# Altium schematic sheet Serial to USB Converter.SchDoc: Serial to USB Converter
size 292 x 193 mm; DocumentNumber: 29; SheetNumber: 16; SheetTotal: 28
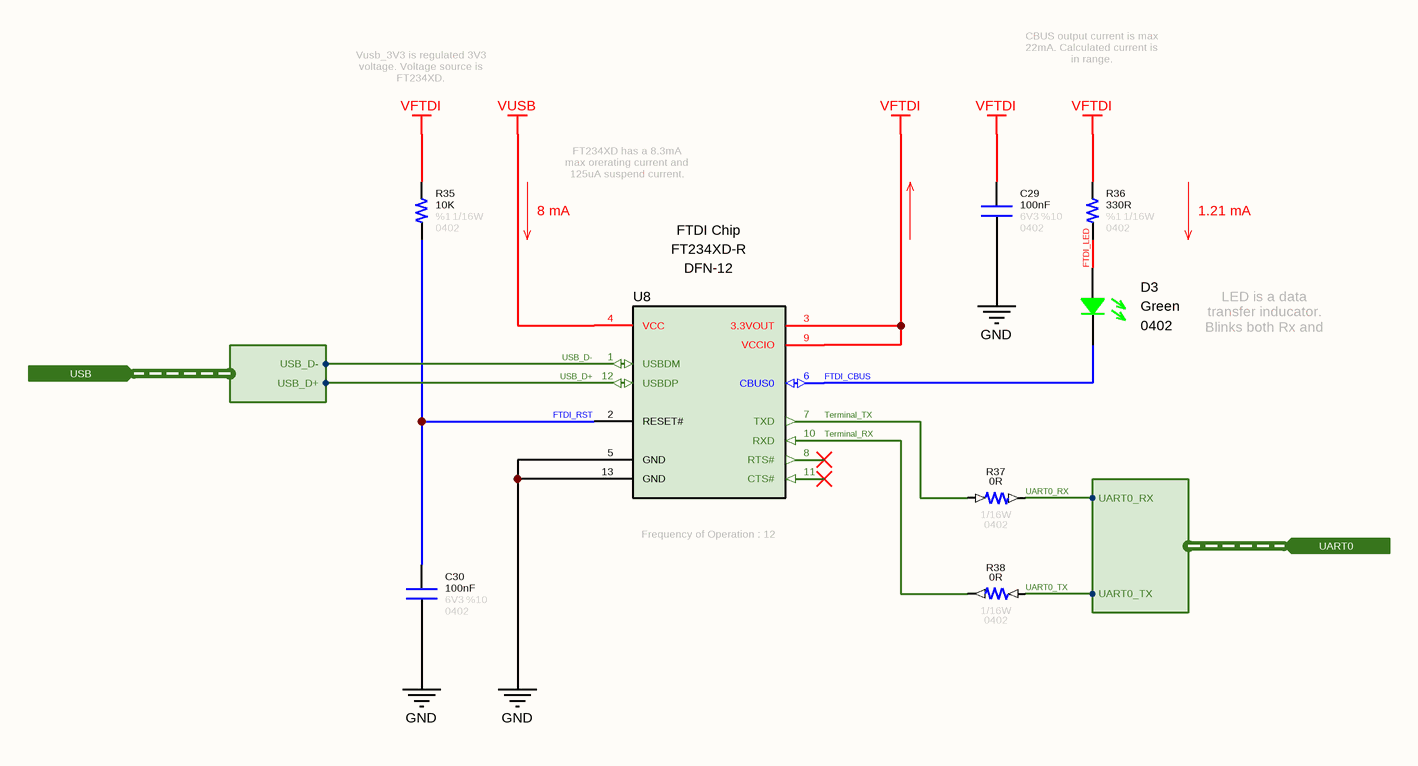
[diagram p0: Serial to USB Converter.SchDoc]

## Parts
C29  value 100nF  Tolerance: %10  Voltage: 6V3  Case: 0402  [CAPACITOR_0402]  (hidden comment: Capacitor - 100nF [0402] (Ceramic))
C30  value 100nF  Tolerance: %10  Voltage: 6V3  Case: 0402  [CAPACITOR_0402]  (hidden comment: Capacitor - 100nF [0402] (Ceramic))
D3  Case: 0402  Color: Green  [LED_0402]  (hidden comment: SMD LED (Green))
R35  value 10K  Tolerance: %1  Case: 0402  Power: 1/16W  [RESISTOR_0402]  (hidden comment: 10K - 0402 - %1 - 1/16W)
R36  value 330R  Case: 0402  Tolerance: %1  Power: 1/16W  [RESISTOR_0402]  (hidden comment: 330R - 0402 - %1 - 1/16W)
R37  value 0R  Case: 0402  Power: 1/16W  [RESISTOR_0402]  (hidden comment: 0R - 0402 - %1 - 1/16W)
R38  value 0R  Case: 0402  Power: 1/16W  [RESISTOR_0402]  (hidden comment: 0R - 0402 - %1 - 1/16W)
U8  Manufacturer Name: FTDI Chip  Case: DFN-12  [FT234XD-R]  (hidden comment: FT234XD-R)

## Ports
UART0 (in, harness UART0), USB (in, harness USB)

## Harnesses
USB: USB_D+, USB_D-
UART0: UART0_RX, UART0_TX

## Nets
GND: C29.1 C30.1 U8.5(GND) U8.13(GND)
VFTDI: C29.2 R35.2 R36.2 U8.3(3.3VOUT) U8.9(VCCIO)
VUSB: U8.4(VCC)
FTDI_CBUS: D3.1 U8.6(CBUS0)
FTDI_LED: D3.2 R36.1
FTDI_RST: C30.2 R35.1 U8.2(RESET#)
Terminal_RX: R38.2 U8.10(RXD)
Terminal_TX: R37.2 U8.7(TXD)
UART0_RX: R37.1 ; port UART0.UART0_RX
UART0_TX: R38.1 ; port UART0.UART0_TX
USB_D+: U8.12(USBDP) ; port USB.USB_D+
USB_D-: U8.1(USBDM) ; port USB.USB_D-

Not connected (* = marked no-connect by the designer): U8 8(RTS#)* 11(CTS#)*

## Notes on the sheet
- CBUS output current is max 22mA. Calculated current is in range.
- Vusb_3V3 is regulated 3V3 voltage. Voltage source is FT234XD.
- 8 mA
- FT234XD has a 8.3mA max orerating current and 125uA suspend current.
- 1.21 mA
- LED is a data transfer inducator. Blinks both Rx and Tx.
- (near U8) Frequency of Operation : 12 MHz
- © 2021 All rights reserved.
  This document may not, in whole or in part, be copied, photocopied, reproduced, translated or converted to any electronic or machine readable from without prior written permission of Mehmet Günce Akkoyun.
  Engineer contact : akkoyun@me.com
- Property of
- Engineer :
- Date :
- Size :
- A4
- Time :
- Project :
- Page :
- /
- Customer :
- Product ID :
- Module ID :
- Version :
- File :
- Revision :

## Library data of the parts
C29 C30 = Capacitor - 100nF [0402-6V3]: Capacitor - 100nF [0402-6V3] (Ceramic); Manufacturer Name: AVX; Manufacturer Part Number: 04026D104KAT4A; ComponentLink1Description: Mouser; ComponentLink1URL: https://www.mouser.com.tr/ProductDetail/AVX/04026D104KAT4A?qs=sGAEpiMZZMs0AnBnWHyRQPg4iYkCw7IMED%2F4kpqgf7w%3D; ComponentLink2Description: DataSheet; ComponentLink2URL: https://www.mouser.com.tr/datasheet/2/40/cx5r-776519.pdf
D3 = Diode - LED (0402-Green): Standard LEDs - SMD MINI-MOLD ULTRA COMPACT GREEN; Manufacturer Name: ROHM Semiconductor; Manufacturer Part Number: SML-P12MTT86R; ROHS: Yes; ComponentLink1Description: DataSheet; ComponentLink1URL: https://www.mouser.com.tr/datasheet/2/348/sml-p1-e-1139198.pdf; ComponentLink2Description: Mouser; ComponentLink2URL: https://www.mouser.com.tr/ProductDetail/ROHM-Semiconductor/SML-P12U2TT86R?qs=sGAEpiMZZMseGfSY3csMkRIBDsfU3UCXJTULB5gem9Ta%252Bp%252BvZ709fg%3D%3D
R35 = Resistor - 10K [0402]: Thick Film Resistors - SMD 1/16 W 10 KOhm 1%; Manufacturer Name: Vishay; Manufacturer Part Number: CRCW040210K0FKED; ComponentLink1Description: DataSheet; ComponentLink1URL: https://www.mouser.com.tr/datasheet/2/427/dcrcwe3-1762152.pdf; ComponentLink2Description: Mouser; ComponentLink2URL: https://www.mouser.com.tr/ProductDetail/Vishay-Dale/CRCW040210K0FKED?qs=sGAEpiMZZMu61qfTUdNhG2DpbjADlD3GcalbOv9utCY%3D
R36 = Resistor - 330R [0402]: Thick Film Resistors - SMD 1/16 W 330 Ohm 1%; Manufacturer Name: Vishay; Manufacturer Part Number: CRCW0402330RFKED; ComponentLink1Description: DataSheet; ComponentLink1URL: https://www.mouser.com.tr/datasheet/2/427/dcrcwe3-1762152.pdf; ComponentLink2Description: Mouser; ComponentLink2URL: https://www.mouser.com.tr/ProductDetail/Vishay-Dale/CRCW0402330RFKED?qs=sGAEpiMZZMu61qfTUdNhG2DpbjADlD3GGS6SwBlLi5Q%3D
R37 R38 = Resistor - 0R [0402]: Thick Film Resistors - SMD 1/16 W 0 Ohm; Manufacturer Name: Vishay; Manufacturer Part Number: CRCW04020000Z0ED; ComponentLink1Description: DataSheet; ComponentLink1URL: https://www.mouser.com.tr/datasheet/2/427/dcrcwe3-1762152.pdf; ComponentLink2Description: Mouser; ComponentLink2URL: https://www.mouser.com.tr/ProductDetail/Vishay-Dale/CRCW04020000Z0ED?qs=sGAEpiMZZMu61qfTUdNhG2DpbjADlD3GG34cJb50zyg%3D
U8 = IC - FT234XD-R: USB Interface IC USB to Serial UART Interface; Data Rate: 12 Mb/s; Interface Type: UART, USB; Number of Ports: 1 Port; Maximum Operating Temperature: + 85 C; Minimum Operating Temperature: - 40 C; Product Type: USB Interface IC; RoHS: Yes; Manufacturer Part Number: FT234XD-R